# Altium schematic sheet circuit page19.SchDoc
size 431 x 279 mm; SheetNumber: 1; SheetTotal: 1; ENG_APP_DATE: --/--/--; DSN_APP_DATE: --/--/--; CHK_APP_DATE: --/--/--
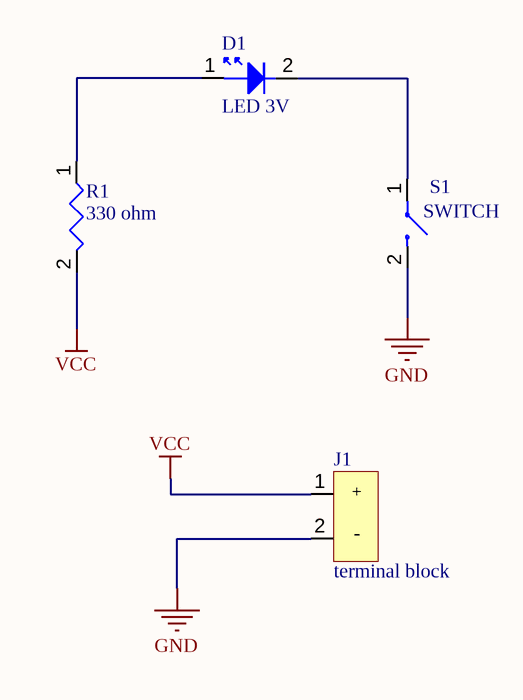
[diagram p0: circuit page19.SchDoc]

## Parts
D1  LED 3V  [led TH]
J1  terminal block  [header]
R1  330 ohm  [330ohm_TH]
S1  SWITCH  [DIP1]

## Nets
GND: J1.2 S1.2
VCC: J1.1 R1.2
NetD1_1: D1.1 R1.1
NetD1_2: D1.2 S1.1

## Notes on the sheet
- DWG. NO.
- REV.
- SHT.
- THIS DOCUMENT AND THE DATA DISCLOSED HEREIN OR HEREWITH IS THE PROPERTY OF ALTIUM LIMITED AND MAY BE FREELY DISTRIBUTED IN WHOLE. NO RIGHTS ARE RESERVED OR EXPRESS OR IMPLIED WARANTEE GIVEN.
- REVISION
- DESCRIPTION
- DATE
- APPROVED
- ENG:
- APPROVALS
- PROJECT
- DSN:
- CHK:
- REFERENCE DOCUMENTS
- PROJECT REVISION:
- TITLE
- DOCUMENT REVISION:
- DESIGN ITEM:
- BOM:
- FAB DWG:
- PCB DWG:
- ASSY DWG:
- SCALE:
- SIZE
- B
- CAGE CODE
- FILE NAME
- DWG NO.
- SHEET
- OF
- REV
- (in symbol terminal block_TH) +; -

## Library data of the parts
D1 = led_TH
J1 = terminal block_TH
R1 = resistor_TH: through hole resistor 330 ohm; Manufacturer: TE Connectivity Passive Product; Manufacturer Product Number: LR1F330R; tolerance: ±1%; power rating: 0.6W; package size: 2.30mm x 6.20mm; Packaging: Cut Tape (CT)
S1 = dip swith1_TH: DIP SWITCH; rated voltage: 24 50 Vdc; rated current: 25 100 Vdc; contact resistance: 50 100 mΩ; insulation resistance: 100 MΩ; withstanding voltage: 300 Vac; ComponentLink1Description: DATASHEET; ComponentLink1URL: https://www.cuidevices.com/product/resource/ds01-254.pdf